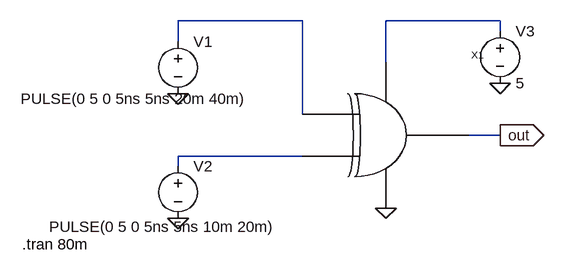
[diagram p0: schematic xorgateimplytest.asc]
xorgateimplytest.asc, the LTspice schematic file:
Version 4
SHEET 1 880 680
WIRE 96 0 -96 0
WIRE 400 0 224 0
WIRE 400 16 400 0
WIRE -96 32 -96 0
WIRE 224 64 224 0
WIRE 96 144 96 0
WIRE 400 176 352 176
WIRE 96 208 -96 208
WIRE -96 224 -96 208
FLAG -96 112 0
FLAG -96 304 0
FLAG 400 96 0
FLAG 224 288 0
FLAG 400 176 out
IOPIN 400 176 Out
SYMBOL xorgateimply 112 176 R0
SYMATTR InstName X1
SYMBOL voltage -96 16 R0
WINDOW 3 -242 104 Left 2
WINDOW 123 0 0 Left 0
WINDOW 39 0 0 Left 0
SYMATTR InstName V1
SYMATTR Value PULSE(0 5 0 5ns 5ns 20m 40m)
SYMBOL voltage -96 208 R0
WINDOW 3 -198 109 Left 2
WINDOW 123 0 0 Left 0
WINDOW 39 0 0 Left 0
SYMATTR InstName V2
SYMATTR Value PULSE(0 5 0 5ns 5ns 10m 20m)
SYMBOL voltage 400 0 R0
WINDOW 123 0 0 Left 0
WINDOW 39 0 0 Left 0
SYMATTR InstName V3
SYMATTR Value 5
TEXT -336 344 Left 2 !.tran 80m

The netlist it stands for:
* xorgateimplytest.asc
XX1 N001 N003 out N002 0 xorgateimply  ; pins A B OUT VDD VSS
V1 N001 0 PULSE(0 5 0 5ns 5ns 20m 40m)
V2 N003 0 PULSE(0 5 0 5ns 5ns 10m 20m)
V3 N002 0 5
.tran 80m
.backanno
.end